# Altium schematic sheet tank_adapter.SchDoc
size A4; SheetNumber: 1; SheetTotal: 2
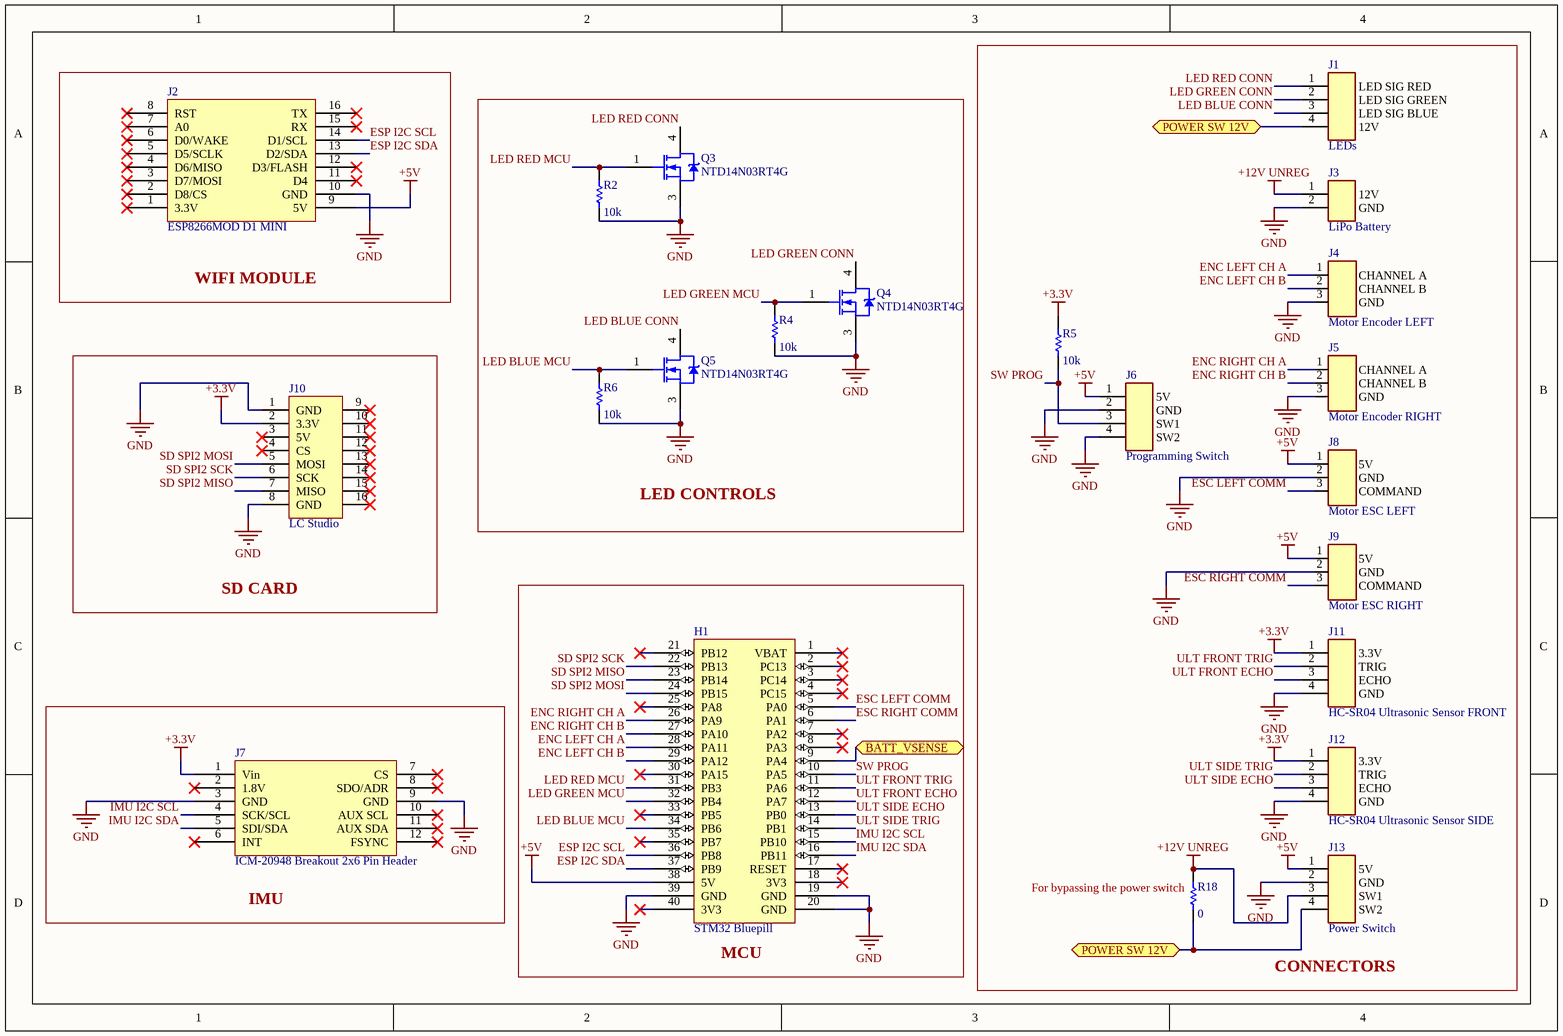
[diagram p0: tank_adapter.SchDoc]

## Parts
H1  STM32 Bluepill  [STM32 Bluepill]
J1  LEDs  [HDRV4W85P254_4X1_1062X650X1000]
J2  ESP8266MOD D1 MINI  [ESP8266MOD D1 MINI]
J3  LiPo Battery  [TE_282837-2]
J4  Motor Encoder LEFT  [TE_282834-3]
J5  Motor Encoder RIGHT  [TE_282834-3]
J6  Programming Switch  [HDRV4W85P254_4X1_1062X650X1000]
J7  ICM-20948 Breakout 2x6 Pin Header  [ICM20948 Breakout]
J8  Motor ESC LEFT  [TE_282834-3]
J9  Motor ESC RIGHT  [TE_282834-3]
J10  LC Studio  [HDR2X8_CEN]
J11  HC-SR04 Ultrasonic Sensor FRONT  [HDRV4W85P254_4X1_1062X650X1000]
J12  HC-SR04 Ultrasonic Sensor SIDE  [HDRV4W85P254_4X1_1062X650X1000]
J13  Power Switch  [HDRV4W85P254_4X1_1062X650X1000]
Q3  NTD14N03RT4G  [ONSC-DPAK-3-369C-01_V]
Q4  NTD14N03RT4G  [ONSC-DPAK-3-369C-01_V]
Q5  NTD14N03RT4G  [ONSC-DPAK-3-369C-01_V]
R2  value 10k  [6-0805_M]  (hidden comment: Res1)
R4  value 10k  [6-0805_M]  (hidden comment: Res1)
R5  value 10k  [6-0805_M]  (hidden comment: Res1)
R6  value 10k  [6-0805_M]  (hidden comment: Res1)
R18  value 0  [6-0805_M]  (hidden comment: Res1)

## Blocks framed on the sheet
WIFI MODULE: J2
CONNECTORS: J1 J3-J6 J8 J9 J11-J13 R5 R18
LED CONTROLS: Q3-Q5 R2 R4 R6
SD CARD: J10
MCU: H1
IMU: J7

## Ports
BATT_VSENSE (bidir), POWER SW 12V (bidir)

## Nets
+3.3V: J7.1(Vin) J10.2(3.3V) J11.1(3.3V) J12.1(3.3V) R5.1
+5V: H1.38(5V) J2.9(5V) J6.1(5V) J8.1(5V) J9.1(5V) J13.1(5V)
+12V UNREG: J3.1(12V) J13.3(SW1) R18.1
GND: H1.19(GND) H1.20(GND) H1.39(GND) J2.10(GND) J3.2(GND) J4.3(GND) J5.3(GND) J6.2(GND) J6.4(SW2) J7.3(GND) J7.9(GND) J8.2(GND) J9.2(GND) J10.1(GND) J10.8(GND) J11.4(GND) J12.4(GND) J13.2(GND) Q3.3(S) Q4.3(S) Q5.3(S) R2.2 R4.2 R6.2
BATT_VSENSE: H1.9(PA4) ; port BATT_VSENSE
ENC LEFT CH A: H1.28(PA11) J4.1(CHANNEL_A)
ENC LEFT CH B: H1.29(PA12) J4.2(CHANNEL_B)
ENC RIGHT CH A: H1.26(PA9) J5.1(CHANNEL_A)
ENC RIGHT CH B: H1.27(PA10) J5.2(CHANNEL_B)
ESC LEFT COMM: H1.5(PA0) J8.3(COMMAND)
ESC RIGHT COMM: H1.6(PA1) J9.3(COMMAND)
ESP I2C SCL: H1.36(PB8) J2.14(D1/SCL)
ESP I2C SDA: H1.37(PB9) J2.13(D2/SDA)
IMU I2C SCL: H1.15(PB10) J7.4(SCK/SCL)
IMU I2C SDA: H1.16(PB11) J7.5(SDI/SDA)
LED BLUE CONN: J1.3(LED_SIG_BLUE) Q5.4(D)
LED BLUE MCU: H1.34(PB6) Q5.1(G) R6.1
LED GREEN CONN: J1.2(LED_SIG_GREEN) Q4.4(D)
LED GREEN MCU: H1.32(PB4) Q4.1(G) R4.1
LED RED CONN: J1.1(LED_SIG_RED) Q3.4(D)
LED RED MCU: H1.31(PB3) Q3.1(G) R2.1
POWER SW 12V: J1.4(12V) J13.4(SW2) R18.2 ; port POWER SW 12V
SD SPI2 MISO: H1.23(PB14) J10.7(MISO)
SD SPI2 MOSI: H1.24(PB15) J10.5(MOSI)
SD SPI2 SCK: H1.22(PB13) J10.6(SCK)
SW PROG: H1.10(PA5) J6.3(SW1) R5.2
ULT FRONT ECHO: H1.12(PA7) J11.3(ECHO)
ULT FRONT TRIG: H1.11(PA6) J11.2(TRIG)
ULT SIDE ECHO: H1.13(PB0) J12.3(ECHO)
ULT SIDE TRIG: H1.14(PB1) J12.2(TRIG)

Not connected (* = marked no-connect by the designer): H1 1(VBAT)* 2(PC13)* 3(PC14)* 4(PC15)* 7(PA2)* 8(PA3)* 17(RESET)* 18(3V3)* 21(PB12)* 25(PA8)* 30(PA15)* 33(PB5)* 35(PB7)* 40(3V3)*; J2 1(3.3V)* 2(D8/CS)* 3(D7/MOSI)* 4(D6/MISO)* 5(D5/SCLK)* 6(D0/WAKE)* 7(A0)* 8(RST)* 11(D4)* 12(D3/FLASH)* 15(RX)* 16(TX)*; J7 2(1.8V)* 6(INT)* 7(CS)* 8(SDO/ADR)* 10(AUX_SCL)* 11(AUX_SDA)* 12(FSYNC)*; J10 3(5V)* 4(CS)* 9* 10* 11* 12* 13* 14* 15* 16*

## Notes on the sheet
- (near R18) For bypassing the power switch

## Library data of the parts
J1 J6 J11-J13 = 282834-4: 4 Position Wire to Board Terminal Block Horizontal with Board 0.100 _2.54mm_ Through Hole; MF: TE Connectivity; Centerline_Pitch: 2.54 mm[.1 in]; Number_of_Positions: 4; Price: None; EU_RoHS_Compliance: Compliant with Exemptions; Availability: Unavailable; SnapEDA_Link: https://www.snapeda.com/parts/282834-4/TE%20Connectivity%20AMP%20Connectors/view-part/448422/?ref=snap; MP: 282834-4; TE_purchase_URL: https://www.te.com/usa-en/product-282834-4.html?te_bu=Cor&te_type=disp&te_campaign=seda_glo_cor-seda-global-disp-prtnr-fy19-seda-model-bom-cta_sma-317_1&elqCampaignId=32493; Value: *; Package: None
J3 = 282837-2: Connector Terminal Blocks Receptacle 2 Position 5.08mm Solder Straight Thru-Hole 13.5A/Contact; MF: TE Connectivity; Price: None; Check_prices: https://www.snapeda.com/parts/282837-2/TE%20Connectivity%20AMP%20Connectors/view-part/2549980/?ref=eda; Package: None; Purchase-URL: https://pricing.snapeda.com/search/part/282837-2/?ref=eda; SnapEDA_Link: https://www.snapeda.com/parts/282837-2/TE%20Connectivity%20AMP%20Connectors/view-part/2549980/?ref=snap; Value: *; MP: 282837-2; Availability: Good
J4 J5 J8 J9 = 282834-3: 3 Position Wire to Board Terminal Block Horizontal with Board 0.100 (2.54mm); MF: TE Connectivity; EU_RoHS_Compliance: Compliant with Exemptions; SnapEDA_Link: https://www.snapeda.com/parts/282834-3/TE%20Connectivity%20AMP%20Connectors/view-part/398089/?ref=snap; Price: None; Check_prices: https://www.snapeda.com/parts/282834-3/TE%20Connectivity%20AMP%20Connectors/view-part/398089/?ref=eda; Purchase-URL: https://pricing.snapeda.com/search/part/282834-3/?ref=eda; Package: None; MP: 282834-3; Value: *; Availability: Good
J7 = ICM-20948 Breakout 2x6 Pin Header: THT Vertical Pin Header WR-PHD, Pitch 2.54 mm, Double Row, 2x6 pins
J10 = Header 8X2A: Header, 8-Pin, Dual row; LatestRevisionDate: 17-Jul-2002; LatestRevisionNote: Re-released for DXP Platform.; Publisher: Altium Limited
Q3-Q5 = CMP-1058-00361-1: Power MOSFET, 14 A, 25 V, N-Channel, 3-Pin DPAK, Pb-Free, Tape and Reel; Manufacturer: On Semiconductor; Configuration: Single; Ciss Typ (pF): 115; Coss Typ (pF): 62; VGS(th) Max (V): 2; Channel Polarity: N Channel; Crss Typ (pF): 33; V(BR)DSS Min (V): 25; VGS Max (V): 20; PackageVersion: Rev. E, 02/2014; RoHS: Pb-Free; ComponentLink2URL: http://www.onsemi.cn/pub_link/Collateral/NTD14N03R-D.PDF; ComponentLink1URL: http://www.onsemi.com/; PackageDescription: 3-Pin Flange Mount, Body 6.54 x 6.095 mm, Pitch 2.29 mm; Package Type: DPAK-3; ComponentLink1Description: Manufacturer URL; Qrr Typ (nC): 2; ComponentLink3URL: http://www.onsemi.cn/pub_link/Collateral/369C.PDF; PackageReference: DPAK-3-369C-01; ComponentLink2Description: Datasheet; DatasheetVersion: Rev. 7; Mounting Technology: Surface Mount; ComponentLink3Description: Package Specification; PartNumber: NTD14N03RT4G; Packing: Tape and Reel
R2 R4-R6 R18 = Res1: Resistor; Published: 8-Jun-2000; LatestRevisionDate: 17-Jul-2002; LatestRevisionNote: Re-released for DXP Platform.; PackageReference: AXIAL-0.3; Publisher: Altium Limited; PackageDescription: Axial Device, Thru-Hole; 2 Leads; 0.3 in Pin Spacing